# EAGLE design node-mcu-pack-single-sided (EAGLE 7.5.0)
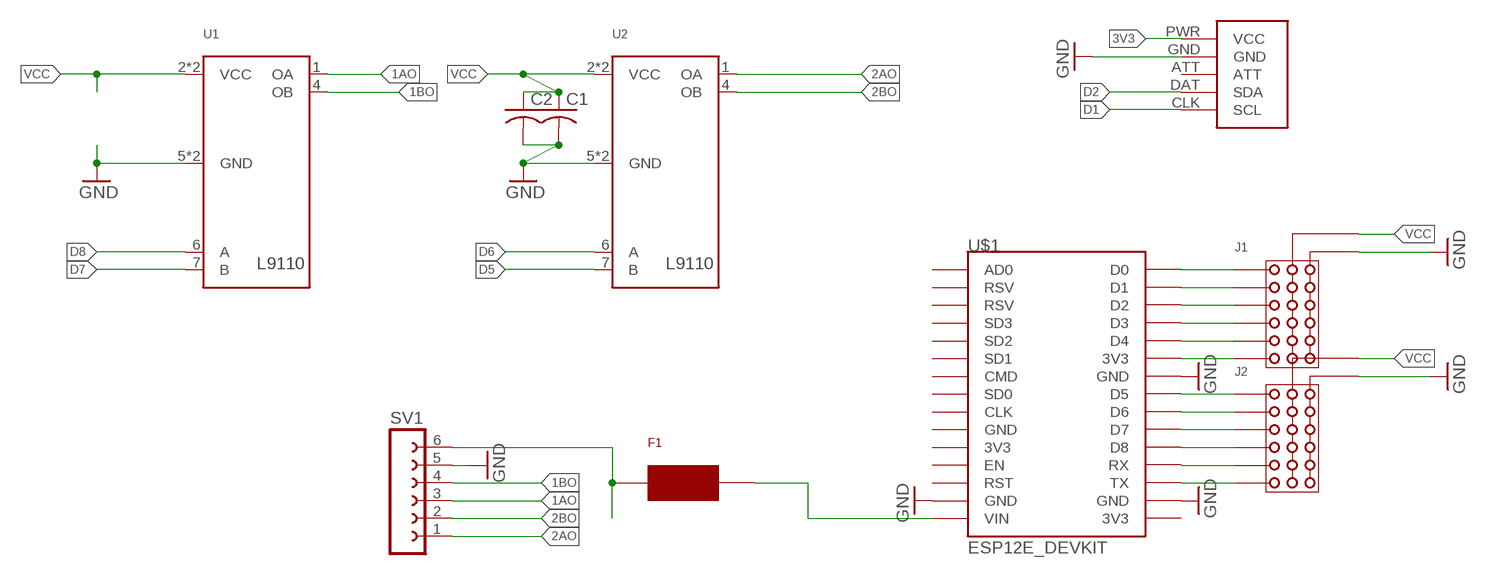
[diagram p0: schematic, sheet 1]

## Parts
C1  C-USC0805  [C0805]
C2  C-USC0805  [C0805]
F1  0154  [0154]
J1  IOBLOCK6  [IOBLOCK100MILX6]
J2  IOBLOCK6  [IOBLOCK100MILX6]
SV1  FE06-1  [FE06]
U1  L9110SMT  [8S1]
U2  L9110SMT  [8S1]
U$1  ESP12E_DEVKIT  [ESP12E_DEVKIT]
U$2  WIICHUCKOUTIE  [CHUCK-OUTIE]

## Nets
1AO: SV1.3 U1.1(OA)
1BO: SV1.4 U1.4(OB)
2AO: SV1.1 U2.1(OA)
2BO: SV1.2 U2.4(OB)
3V3: J1.P$6 U$1.3V3@1(3V3) U$2.PWR(VCC)
D0: J1.P$1 U$1.D0
D1: J1.P$2 U$1.D1 U$2.CLK(SCL)
D2: J1.P$3 U$1.D2 U$2.DAT(SDA)
D5: J2.P$1 U2.7(B) U$1.D5
D6: J2.P$2 U2.6(A) U$1.D6
D7: J2.P$3 U1.7(B) U$1.D7
D8: J2.P$4 U1.6(A) U$1.D8
GND: C1.2 C2.2 J1.G1 J1.G2 J1.G3 J1.G4 J1.G5 J1.G6 J2.G1 J2.G2 J2.G3 J2.G4 J2.G5 J2.G6 SV1.5 U1.5(GND) U1.8(GND) U2.5(GND) U2.8(GND) U$1.GND@1(GND) U$1.GND@2(GND) U$1.GND@3(GND) U$2.GND
N$1: F1.1 SV1.6
N$4: J2.P$6 U$1.TX
N$5: J2.P$5 U$1.RX
N$11: J1.P$5 U$1.D4
N$12: J1.P$4 U$1.D3
VCC: C1.1 C2.1 F1.2 J1.P1 J1.P2 J1.P3 J1.P4 J1.P5 J1.P6 J2.P1 J2.P2 J2.P3 J2.P4 J2.P5 J2.P6 U1.2(VCC) U1.3(VCC) U2.2(VCC) U2.3(VCC) U$1.VIN
Unconnected: U$1.3V3@0(3V3) U$1.3V3@2(3V3) U$1.AD0 U$1.CLK U$1.CMD U$1.EN U$1.GND@0(GND) U$1.RST U$1.RSV@0(RSV) U$1.RSV@1(RSV) U$1.SD0 U$1.SD1 U$1.SD2 U$1.SD3 U$2.ATT

## Library data of the parts
C1 C2 = adafruit:C-US: CAPACITOR, American symbol
F1 = SMT_Fuse_0154001:0154
J1 J2 = ioblock:IOBLOCK6
SV1 = con-lsta:FE06-1: FEMALE HEADER; OC_FARNELL: unknown; OC_NEWARK: unknown
U1 U2 = L9110h:L9110
U$1 = ESP12E_DEVKIT:ESP12E_DEVKIT: ESP12E DEVKIT BOARD
U$2 = wiichuck:WIICHUCK

## Board
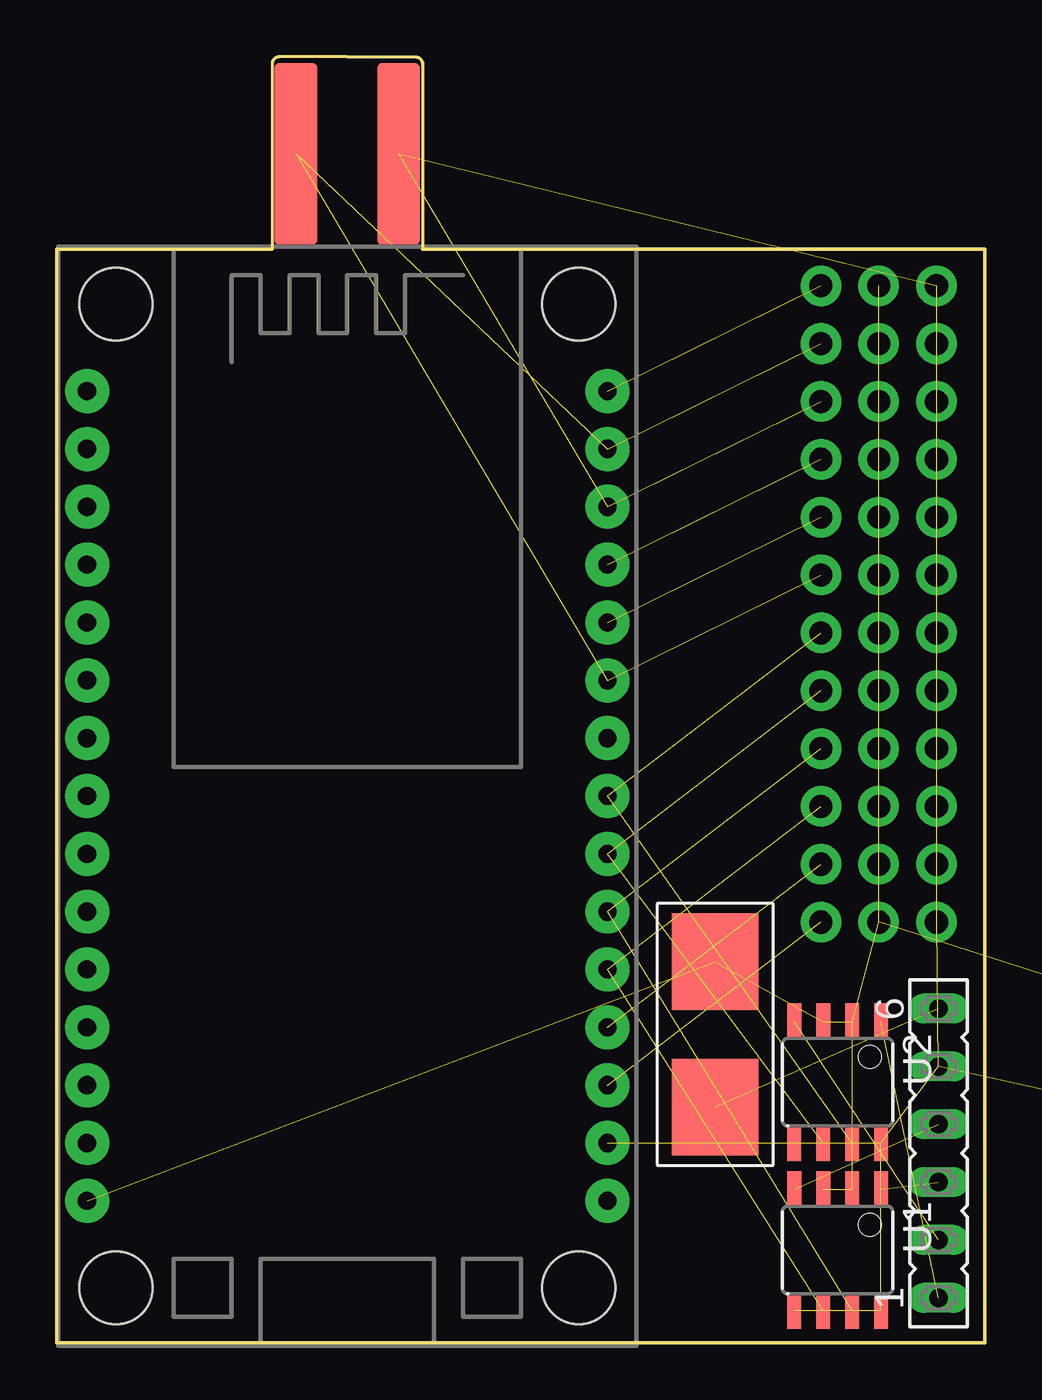
[diagram p1: board, top side]
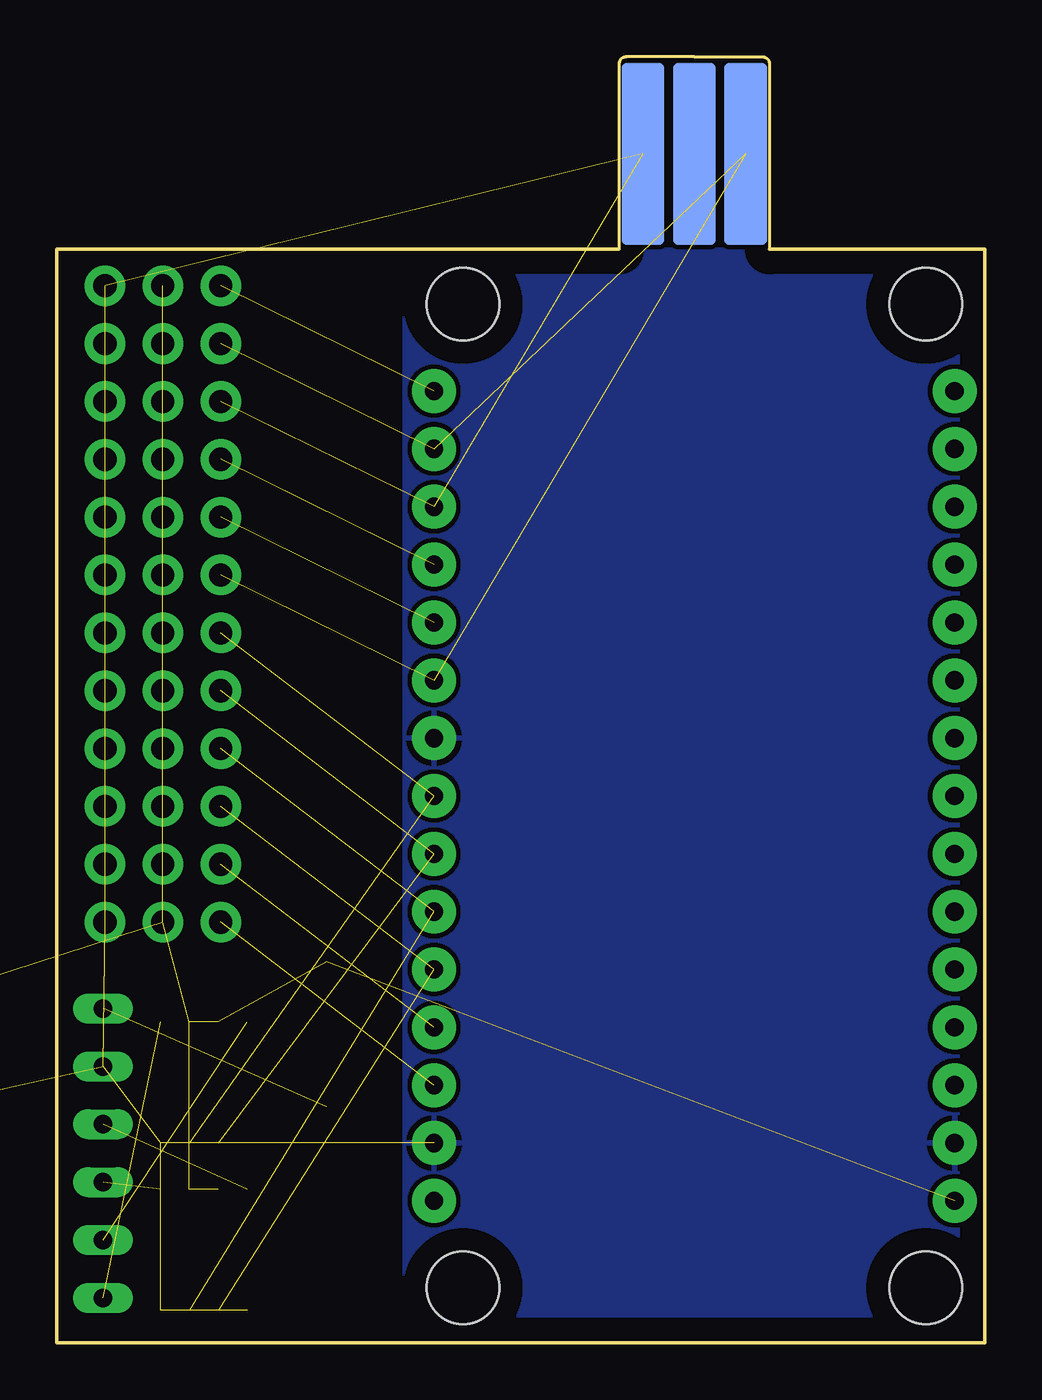
[diagram p2: board, bottom side, seen from below]

Size 40.74 x 56.45 mm. Coordinates in mm from the lower left corner, seen from the top.
Outline: 9.45,48 0,48 0,0 40.74,0 40.74,48 16.05,48
Copper layers (1*16): Top 0.035mm / dielectric 1.5mm / Bottom 0.035mm
Design rules "default": minimum track width 10mil, minimum drill 24mil, track to track 8mil, track to pad 8mil, pad to pad 8mil, via to via 8mil, smd to smd 8mil, copper to edge 40mil, drill to drill 8mil, minimum pad ring 10mil, minimum via ring 8mil, stop-mask expansion 4mil, vias tented up to drill 0mil, thermal gap 10mil

### Footprints (pad centres in the part's own frame; a part is rotated, then mirrored left to right if it is on the bottom)
C0805 = smd 1.3 x 1.5: 1 -0.85,0; 2 0.85,0
0154 = smd 4.24 x 3.81: 1 0,0; 2 6.38,0
IOBLOCK100MILX6 = drill 1.016 pad 1.778: G1 -5.08,5.08; G2 -2.54,5.08; G3 0,5.08; G4 2.54,5.08; G5 5.08,5.08; G6 7.62,5.08; P1 -5.08,2.54; P2 -2.54,2.54; P3 0,2.54; P4 2.54,2.54; P5 5.08,2.54; P6 7.62,2.54; P$1 -5.08,0; P$2 -2.54,0; P$3 0,0; P$4 2.54,0; P$5 5.08,0; P$6 7.62,0
FE06 = drill 0.813 long: 1 -6.35,0; 2 -3.81,0; 3 -1.27,0; 4 1.27,0; 5 3.81,0; 6 6.35,0
8S1 = smd 0.6 x 1.6: 1 -1.905,-2.654; 2 -0.645,-2.654; 3 0.625,-2.654; 4 1.895,-2.654; 5 1.905,2.654; 6 0.635,2.654; 7 -0.635,2.654; 8 -1.905,2.654
ESP12E_DEVKIT = drill 0.8 pad 1.93: 3V3@0 -11.43,-7.62; 3V3@1 11.43,5.08; 3V3@2 11.43,-17.78; AD0 -11.43,17.78; CLK -11.43,-2.54; CMD -11.43,2.54; D0 11.43,17.78; D1 11.43,15.24; D2 11.43,12.7; D3 11.43,10.16; D4 11.43,7.62; D5 11.43,0; D6 11.43,-2.54; D7 11.43,-5.08; D8 11.43,-7.62; EN -11.43,-10.16; GND@0 -11.43,-5.08; GND@1 -11.43,-15.24; GND@2 11.43,2.54; GND@3 11.43,-15.24; RST -11.43,-12.7; RSV@0 -11.43,15.24; RSV@1 -11.43,12.7; RX 11.43,-10.16; SD0 -11.43,0; SD1 -11.43,5.08; SD2 -11.43,7.62; SD3 -11.43,10.16; TX 11.43,-12.7; VIN -11.43,-17.78 | hole 3.2: -10.16,21.59; 10.16,21.59; 10.16,-21.59; -10.16,-21.59
CHUCK-OUTIE = smd 8 x 1.88 bottom: ATT 4.2,0; DAT 4.2,-2.255; PWR 4.2,2.255 | smd 8 x 1.88: CLK 4.2,2.255; GND 4.2,-2.255

### Placement (x,y rotation side)
C1  49.59,13.3 270 top  (outside the outline)
C2  49.25,8.93 90 top  (outside the outline)
F1  28.9,10.34 90 top
J1  33.55,41.32 270 top
J2  33.55,26.08 270 top
SV1  38.72,8.31 90 top
U1  34.28,4.06 180 top
U2  34.28,11.43 180 top
U$1  12.75,24 0 top
U$2  12.75,48 90 top

### Tracks (layer width: path | path; a pad name or v marks a point on that pad's centre or on a via)
1AO  (1 unrouted)
1BO  (1 unrouted)
2AO  (1 unrouted)
2BO  (1 unrouted)
3V3  (2 unrouted)
D0  (1 unrouted)
D1  (2 unrouted)
D2  (2 unrouted)
D5  (2 unrouted)
D6  (2 unrouted)
D7  (2 unrouted)
D8  (2 unrouted)
GND  (20 unrouted)
  pour Bottom: 0,48 0,0 25.5,0 25.5,48
N$1  (1 unrouted)
N$4  (1 unrouted)
N$5  (1 unrouted)
N$11  (1 unrouted)
N$12  (1 unrouted)
VCC  (19 unrouted)